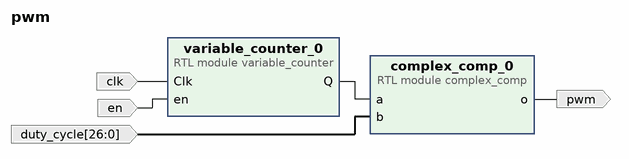
[diagram p0: block diagram of the top level]
# Vivado block design pwm, xc7z020clg400-1, Vivado 2023.2
create_bd_design pwm

create_bd_port -dir I clk
create_bd_port -dir O pwm
create_bd_port -dir I en
create_bd_port -dir I -from 26 -to 0 duty_cycle

create_bd_cell -type module -reference complex_comp complex_comp_0
set_property -dict {CONFIG.nbits 27} [get_bd_cells complex_comp_0]
create_bd_cell -type module -reference variable_counter variable_counter_0
set_property -dict {CONFIG.max_count_value 1000 CONFIG.n_bits 27} [get_bd_cells variable_counter_0]

# ---- connections ----

connect_bd_net -net b_0_1 [get_bd_ports duty_cycle] [get_bd_pins complex_comp_0/b]
connect_bd_net [get_bd_ports clk] [get_bd_pins variable_counter_0/Clk]
connect_bd_net [get_bd_pins complex_comp_0/o] [get_bd_ports pwm]
connect_bd_net -net en_0_1 [get_bd_ports en] [get_bd_pins variable_counter_0/en]
connect_bd_net [get_bd_pins variable_counter_0/Q] [get_bd_pins complex_comp_0/a]

validate_bd_design
save_bd_design
